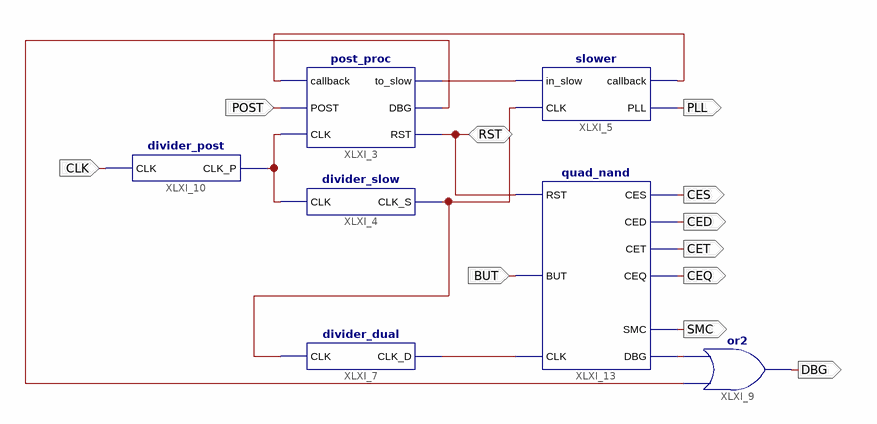
[diagram p0: schematic sheet 1]
// Xilinx ISE schematic overall.sch (xbr) as structural Verilog: 7 symbols, 11 ports
module overall (
  input  POST,
  input  BUT,
  input  CLK,
  inout  RST,
  output PLL,
  output SMC,
  output DBG,
  output CES,
  output CED,
  output CEQ,
  output CET
);

  wire XLXN_6, XLXN_7, XLXN_11, XLXN_15, XLXN_16, XLXN_37, XLXN_41;

  post_proc XLXI_3 (.CLK(XLXN_15), .to_slow(XLXN_6), .DBG(XLXN_41), .RST(RST), .POST(POST), .callback(XLXN_11));
  divider_slow XLXI_4 (.CLK(XLXN_15), .CLK_S(XLXN_7));
  slower XLXI_5 (.CLK(XLXN_7), .in_slow(XLXN_6), .PLL(PLL), .callback(XLXN_11));
  divider_post XLXI_10 (.CLK(CLK), .CLK_P(XLXN_15));
  or XLXI_9 (DBG, XLXN_41, XLXN_37);
  divider_dual XLXI_7 (.CLK(XLXN_7), .CLK_D(XLXN_16));
  quad_nand XLXI_13 (
    .RST(RST), .CES(CES), .CED(CED), .CET(CET), .CEQ(CEQ), .CLK(XLXN_16), .BUT(BUT), .SMC(SMC), .DBG(XLXN_37));
endmodule
